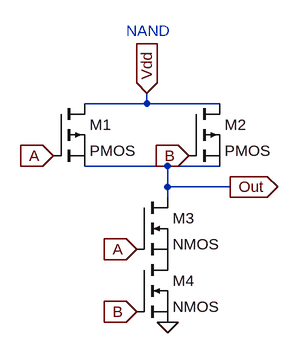
[diagram p0: schematic NANDgate.asc]
NANDgate.asc, the LTspice schematic file:
Version 4.1
SHEET 1 880 680
WIRE 320 64 320 48
WIRE 320 64 224 64
WIRE 432 64 320 64
WIRE 352 160 224 160
WIRE 432 160 352 160
WIRE 352 192 352 160
WIRE 448 192 352 192
WIRE 352 208 352 192
FLAG 176 144 A
IOPIN 176 144 In
FLAG 304 288 A
IOPIN 304 288 In
FLAG 384 144 B
IOPIN 384 144 In
FLAG 304 384 B
IOPIN 304 384 In
FLAG 352 400 0
FLAG 320 48 Vdd
IOPIN 320 48 In
FLAG 448 192 Out
IOPIN 448 192 Out
SYMBOL pmos 176 64 R0
SYMATTR InstName M1
SYMBOL pmos 384 64 R0
SYMATTR InstName M2
SYMBOL nmos 304 208 R0
SYMATTR InstName M3
SYMBOL nmos 304 304 R0
SYMATTR InstName M4
TEXT 288 -48 Left 2 ;NAND

The netlist it stands for:
* NANDgate.asc
M1 Vdd A Out Out PMOS
M2 Vdd B Out Out PMOS
M3 Out A P001 P001 NMOS
M4 P001 B 0 0 NMOS
.model NMOS NMOS
.model PMOS PMOS
.lib standard.mos
* NAND
.backanno
.end